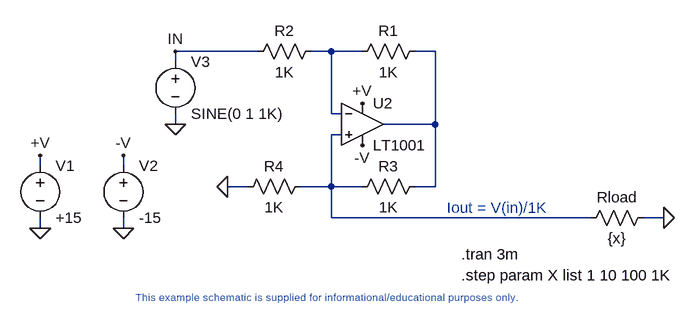
[diagram p0: schematic Howland.asc]
Howland.asc, the LTspice schematic file:
Version 4
SHEET 1 880 696
WIRE 32 160 -96 160
WIRE 144 160 112 160
WIRE 192 160 144 160
WIRE 304 160 272 160
WIRE -96 176 -96 160
WIRE 144 256 144 160
WIRE 160 256 144 256
WIRE -96 272 -96 256
WIRE 304 272 304 160
WIRE 304 272 224 272
WIRE 160 288 144 288
WIRE -304 336 -304 320
WIRE -176 336 -176 320
WIRE 16 368 -16 368
WIRE 144 368 144 288
WIRE 144 368 96 368
WIRE 192 368 144 368
WIRE 304 368 304 272
WIRE 304 368 272 368
WIRE 144 416 144 368
WIRE 544 416 144 416
WIRE 656 416 624 416
WIRE -304 432 -304 416
WIRE -176 432 -176 416
FLAG -176 432 0
FLAG -304 432 0
FLAG 192 240 +V
FLAG -304 320 +V
FLAG -176 320 -V
FLAG 192 304 -V
FLAG -96 272 0
FLAG -96 160 IN
FLAG -16 368 0
FLAG 656 416 0
SYMBOL voltage -304 320 R0
SYMATTR InstName V1
SYMATTR Value +15
SYMBOL voltage -176 320 R0
SYMATTR InstName V2
SYMATTR Value -15
SYMBOL res 288 144 R90
WINDOW 0 0 56 VBottom 2
WINDOW 3 32 56 VTop 2
SYMATTR InstName R1
SYMATTR Value 1K
SYMBOL res 128 144 R90
WINDOW 0 0 56 VBottom 2
WINDOW 3 32 56 VTop 2
SYMATTR InstName R2
SYMATTR Value 1K
SYMBOL voltage -96 160 R0
WINDOW 123 0 0 Left 2
WINDOW 39 0 0 Left 2
SYMATTR InstName V3
SYMATTR Value SINE(0 1 1K)
SYMBOL res 288 352 R90
WINDOW 0 0 56 VBottom 2
WINDOW 3 32 56 VTop 2
SYMATTR InstName R3
SYMATTR Value 1K
SYMBOL res 112 352 R90
WINDOW 0 0 56 VBottom 2
WINDOW 3 32 56 VTop 2
SYMATTR InstName R4
SYMATTR Value 1K
SYMBOL res 528 432 R270
WINDOW 0 32 56 VTop 2
WINDOW 3 0 56 VBottom 2
SYMATTR InstName Rload
SYMATTR Value {x}
SYMBOL opamps\\LT1001 192 208 R0
SYMATTR InstName U2
TEXT 344 472 Left 2 !.tran 3m
TEXT 344 504 Left 2 !.step param X list 1 10 100 1K
TEXT 400 416 Bottom 2 ;Iout = V(in)/1K
TEXT 128 528 Top 1 ;This example schematic is supplied for informational/educational purposes only.

The netlist it stands for:
* Howland.asc
V1 +V 0 +15
V2 -V 0 -15
R1 N002 N001 1K
R2 N001 IN 1K
V3 IN 0 SINE(0 1 1K)
R3 N002 N003 1K
R4 N003 0 1K
Rload N003 0 {x}
XU2 N003 N001 +V -V N002 LT1001  ; pins In+ In- V+ V- OUT
.tran 3m
.step param X list 1 10 100 1K
* Iout = V(in)/1K
* This example schematic is supplied for informational/educational purposes only.
.lib LTC.lib
.backanno
.end